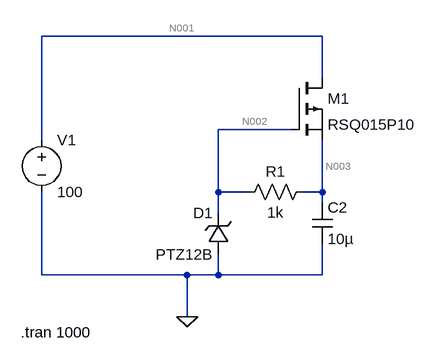
[diagram p0: schematic 12_V_source_pchannel.asc]
12_V_source_pchannel.asc, the LTspice schematic file:
Version 4
SHEET 1 880 680
WIRE 576 -144 144 -144
WIRE 576 -80 576 -144
WIRE 528 0 416 0
WIRE 144 16 144 -144
WIRE 416 96 416 0
WIRE 464 96 416 96
WIRE 576 96 576 16
WIRE 576 96 544 96
WIRE 576 112 576 96
WIRE 416 128 416 96
WIRE 144 224 144 96
WIRE 368 224 144 224
WIRE 416 224 416 192
WIRE 416 224 368 224
WIRE 576 224 576 176
WIRE 576 224 416 224
WIRE 368 288 368 224
FLAG 368 288 0
SYMBOL voltage 144 0 R0
WINDOW 123 0 0 Left 2
WINDOW 39 0 0 Left 2
SYMATTR InstName V1
SYMATTR Value 100
SYMBOL cap 560 112 R0
SYMATTR InstName C2
SYMATTR Value 10µ
SYMBOL pmos 528 -80 R0
SYMATTR InstName M1
SYMATTR Value RSQ015P10
SYMBOL zener 432 192 R180
WINDOW 0 24 64 Left 2
WINDOW 3 24 0 Left 2
SYMATTR InstName D1
SYMATTR Value PTZ12B
SYMBOL res 560 80 R90
WINDOW 0 0 56 VBottom 2
WINDOW 3 32 56 VTop 2
SYMATTR InstName R1
SYMATTR Value 1k
TEXT 112 312 Left 2 !.tran 1000

The netlist it stands for:
* 12_V_source_pchannel.asc
V1 N001 0 100
C2 N003 0 10µ
M1 N001 N002 N003 N003 RSQ015P10
D1 0 N002 PTZ12B
R1 N003 N002 1k
.model D D
.lib standard.dio
.model NMOS NMOS
.model PMOS PMOS
.lib standard.mos
.tran 1000
.backanno
.end

* Results of the author's LTspice run, read from the files saved beside the schematic
* Operating Point, zero values left out:
*   V(n001) = 100 V
*   V(n003) = 99.97 V
*   V(n002) = 12.5 V
*   Id(M1) = 87.47 mA
*   Is(M1) = -87.47 mA
*   I(D1) = -87.47 mA
*   I(R1) = 87.47 mA
*   I(V1) = -87.47 mA